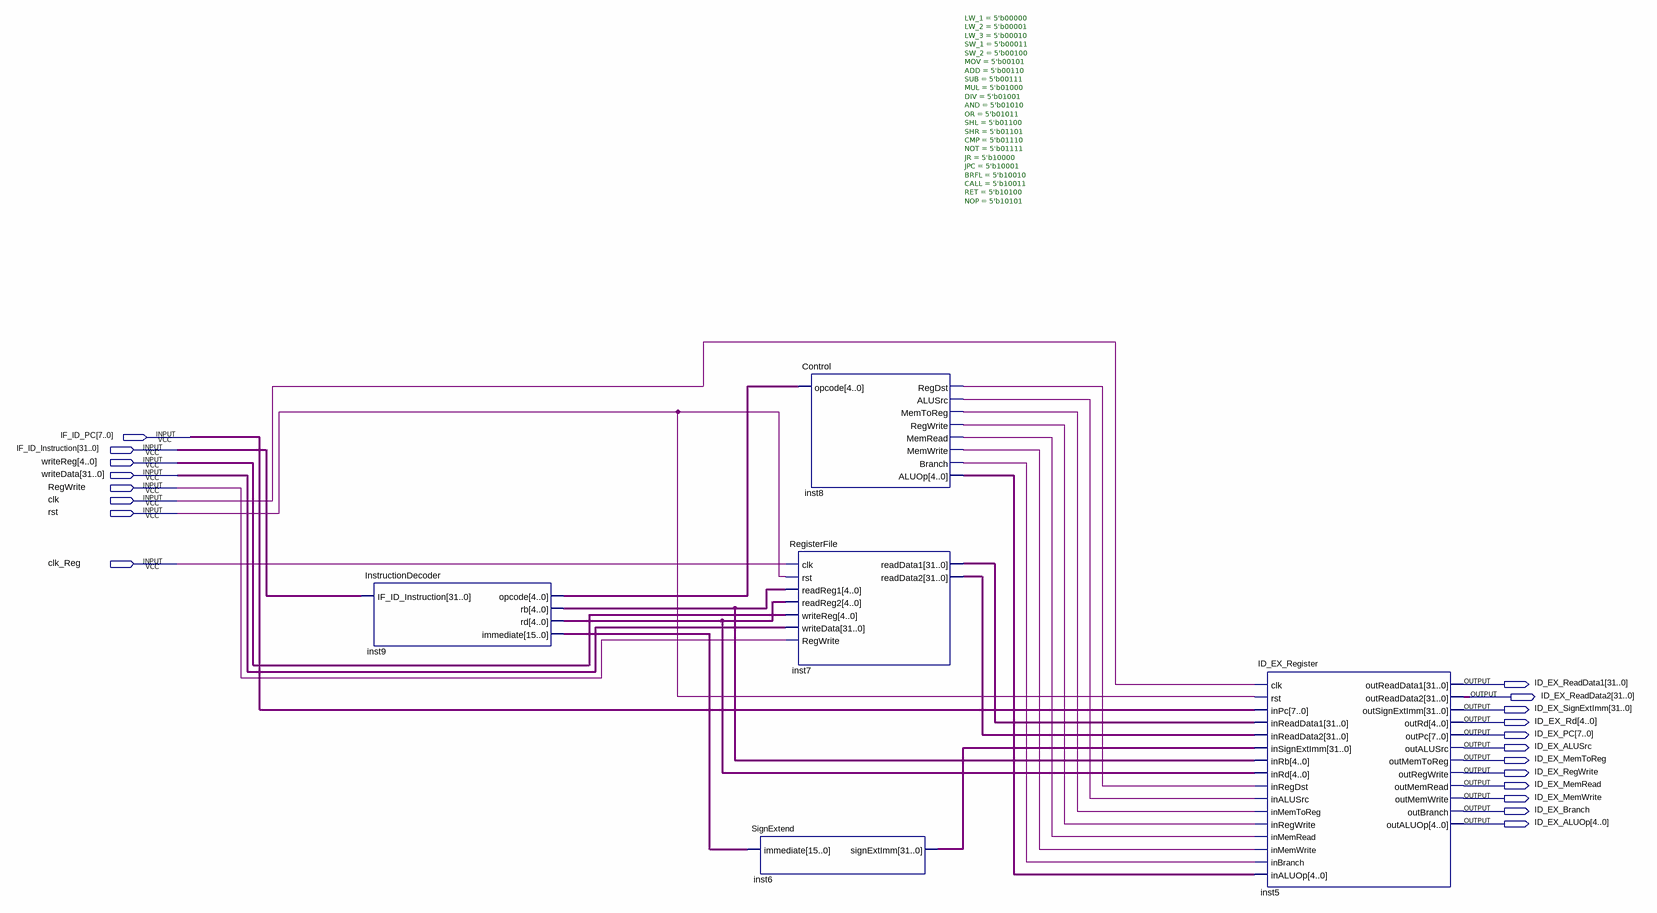
[diagram p0: schematic sheet]
// Quartus schematic ID_STAGE.bdf as structural Verilog: 5 symbols, 20 pins
module ID_STAGE (
  input  [7:0] IF_ID_PC,
  input  [31:0] IF_ID_Instruction,
  input  [4:0] writeReg,
  input  [31:0] writeData,
  input  RegWrite,
  input  clk,
  input  rst,
  input  clk_Reg,
  output [31:0] ID_EX_ReadData1,
  output [31:0] ID_EX_ReadData2,
  output [31:0] ID_EX_SignExtImm,
  output [4:0] ID_EX_Rd,
  output [7:0] ID_EX_PC,
  output ID_EX_ALUSrc,
  output ID_EX_MemToReg,
  output ID_EX_RegWrite,
  output ID_EX_MemRead,
  output ID_EX_MemWrite,
  output ID_EX_Branch,
  output [4:0] ID_EX_ALUOp
);

  wire inst8_alusrc, inst8_branch, inst8_memread, inst8_memtoreg, inst8_memwrite, inst8_regdst,
       inst8_regwrite;
  wire [4:0] inst8_aluop, inst9_opcode, inst9_rb, inst9_rd;
  wire [15:0] inst9_immediate;
  wire [31:0] inst6_signextimm, inst7_readdata1, inst7_readdata2;

  InstructionDecoder inst9 (
    .IF_ID_Instruction(IF_ID_Instruction), .opcode(inst9_opcode), .rb(inst9_rb), .rd(inst9_rd),
    .immediate(inst9_immediate));
  SignExtend inst6 (.immediate(inst9_immediate), .signExtImm(inst6_signextimm));
  Control #(.LW_1(5'b00000), .LW_2(5'b00001), .LW_3(5'b00010), .SW_1(5'b00011), .SW_2(5'b00100), .MOV(5'b00101), .ADD(5'b00110), .SUB(5'b00111), .MUL(5'b01000), .DIV(5'b01001), .AND(5'b01010), .OR(5'b01011), .SHL(5'b01100), .SHR(5'b01101), .CMP(5'b01110), .NOT(5'b01111), .JR(5'b10000), .JPC(5'b10001), .BRFL(5'b10010), .CALL(5'b10011), .RET(5'b10100), .NOP(5'b10101)) inst8 (
    .opcode(inst9_opcode), .RegDst(inst8_regdst), .ALUSrc(inst8_alusrc), .MemToReg(inst8_memtoreg),
    .RegWrite(inst8_regwrite), .MemRead(inst8_memread), .MemWrite(inst8_memwrite), .Branch(inst8_branch),
    .ALUOp(inst8_aluop));
  RegisterFile inst7 (
    .clk(clk_Reg), .rst(rst), .readReg1(inst9_rb), .readReg2(inst9_rd), .writeReg(writeReg),
    .writeData(writeData), .RegWrite(RegWrite), .readData1(inst7_readdata1), .readData2(inst7_readdata2));
  ID_EX_Register inst5 (
    .clk(clk), .rst(rst), .inPc(IF_ID_PC), .inReadData1(inst7_readdata1), .inReadData2(inst7_readdata2),
    .inSignExtImm(inst6_signextimm), .inRb(inst9_rb), .inRd(inst9_rd), .inRegDst(inst8_regdst),
    .inALUSrc(inst8_alusrc), .inMemToReg(inst8_memtoreg), .inRegWrite(inst8_regwrite),
    .inMemRead(inst8_memread), .inMemWrite(inst8_memwrite), .inBranch(inst8_branch), .inALUOp(inst8_aluop),
    .outReadData1(ID_EX_ReadData1), .outReadData2(ID_EX_ReadData2), .outSignExtImm(ID_EX_SignExtImm),
    .outRd(ID_EX_Rd), .outPc(ID_EX_PC), .outALUSrc(ID_EX_ALUSrc), .outMemToReg(ID_EX_MemToReg),
    .outRegWrite(ID_EX_RegWrite), .outMemRead(ID_EX_MemRead), .outMemWrite(ID_EX_MemWrite),
    .outBranch(ID_EX_Branch), .outALUOp(ID_EX_ALUOp));
endmodule
